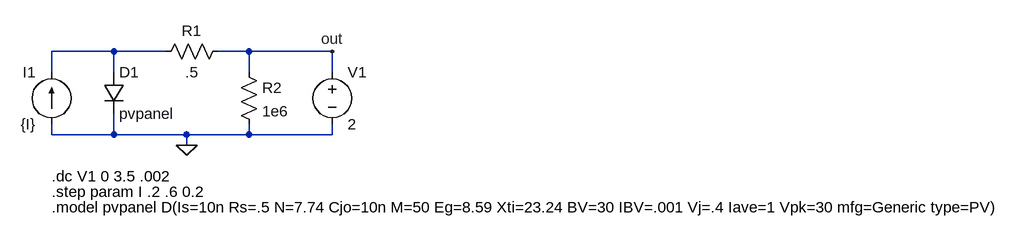
[diagram p0: schematic pvmodel.asc]
pvmodel.asc, the LTspice schematic file:
Version 4
SHEET 1 1596 680
WIRE 208 256 112 256
WIRE 288 256 208 256
WIRE 416 256 368 256
WIRE 544 256 416 256
WIRE 112 288 112 256
WIRE 208 288 208 256
WIRE 416 288 416 256
WIRE 544 288 544 256
WIRE 112 384 112 368
WIRE 208 384 208 352
WIRE 208 384 112 384
WIRE 320 384 208 384
WIRE 416 384 416 368
WIRE 416 384 320 384
WIRE 544 384 544 368
WIRE 544 384 416 384
WIRE 320 400 320 384
FLAG 320 400 0
FLAG 544 256 out
SYMBOL current 112 368 R180
WINDOW 0 24 80 Left 2
WINDOW 3 24 0 Left 2
SYMATTR InstName I1
SYMATTR Value {I}
SYMBOL Diode 192 288 R0
SYMATTR InstName D1
SYMATTR Value pvpanel
SYMBOL Res 384 240 R90
WINDOW 0 0 56 VBottom 2
WINDOW 3 32 56 VTop 2
SYMATTR InstName R1
SYMATTR Value .5
SYMBOL Res 400 272 R0
SYMATTR InstName R2
SYMATTR Value 1e6
SYMBOL voltage 544 272 R0
SYMATTR InstName V1
SYMATTR Value 2
TEXT 112 448 Left 2 !.dc V1 0 3.5 .002
TEXT 112 472 Left 2 !.step param I .2 .6 0.2
TEXT 112 496 Left 2 !.model pvpanel D(Is=10n Rs=.5 N=7.74 Cjo=10n M=50 Eg=8.59 Xti=23.24 BV=30 IBV=.001 Vj=.4 Iave=1 Vpk=30 mfg=Generic type=PV)

The netlist it stands for:
* pvmodel.asc
I1 0 N001 {I}
D1 N001 0 pvpanel
R1 out N001 .5
R2 out 0 1e6
V1 out 0 2
.model D D
.lib standard.dio
.dc V1 0 3.5 .002
.step param I .2 .6 0.2
.model pvpanel D(Is=10n Rs=.5 N=7.74 Cjo=10n M=50 Eg=8.59 Xti=23.24 BV=30 IBV=.001 Vj=.4 Iave=1 Vpk=30 mfg=Generic type=PV)
.backanno
.end